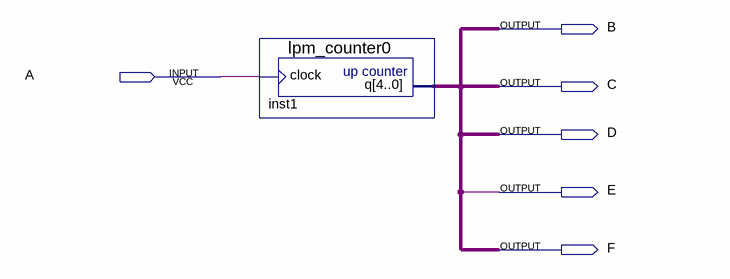
[diagram p0: schematic sheet]
// Quartus schematic lab21_counter.bdf as structural Verilog: 1 symbols, 6 pins
module lab21_counter (
  input  A,
  output B,
  output C,
  output D,
  output E,
  output F
);

  wire [4:0] inst1_q;

  lpm_counter0 inst1 (.clock(A), .q(inst1_q));
endmodule
